# EAGLE design X16_PowerSlab_V2 (EAGLE 9.6.2)

## Sheet 1 of 2
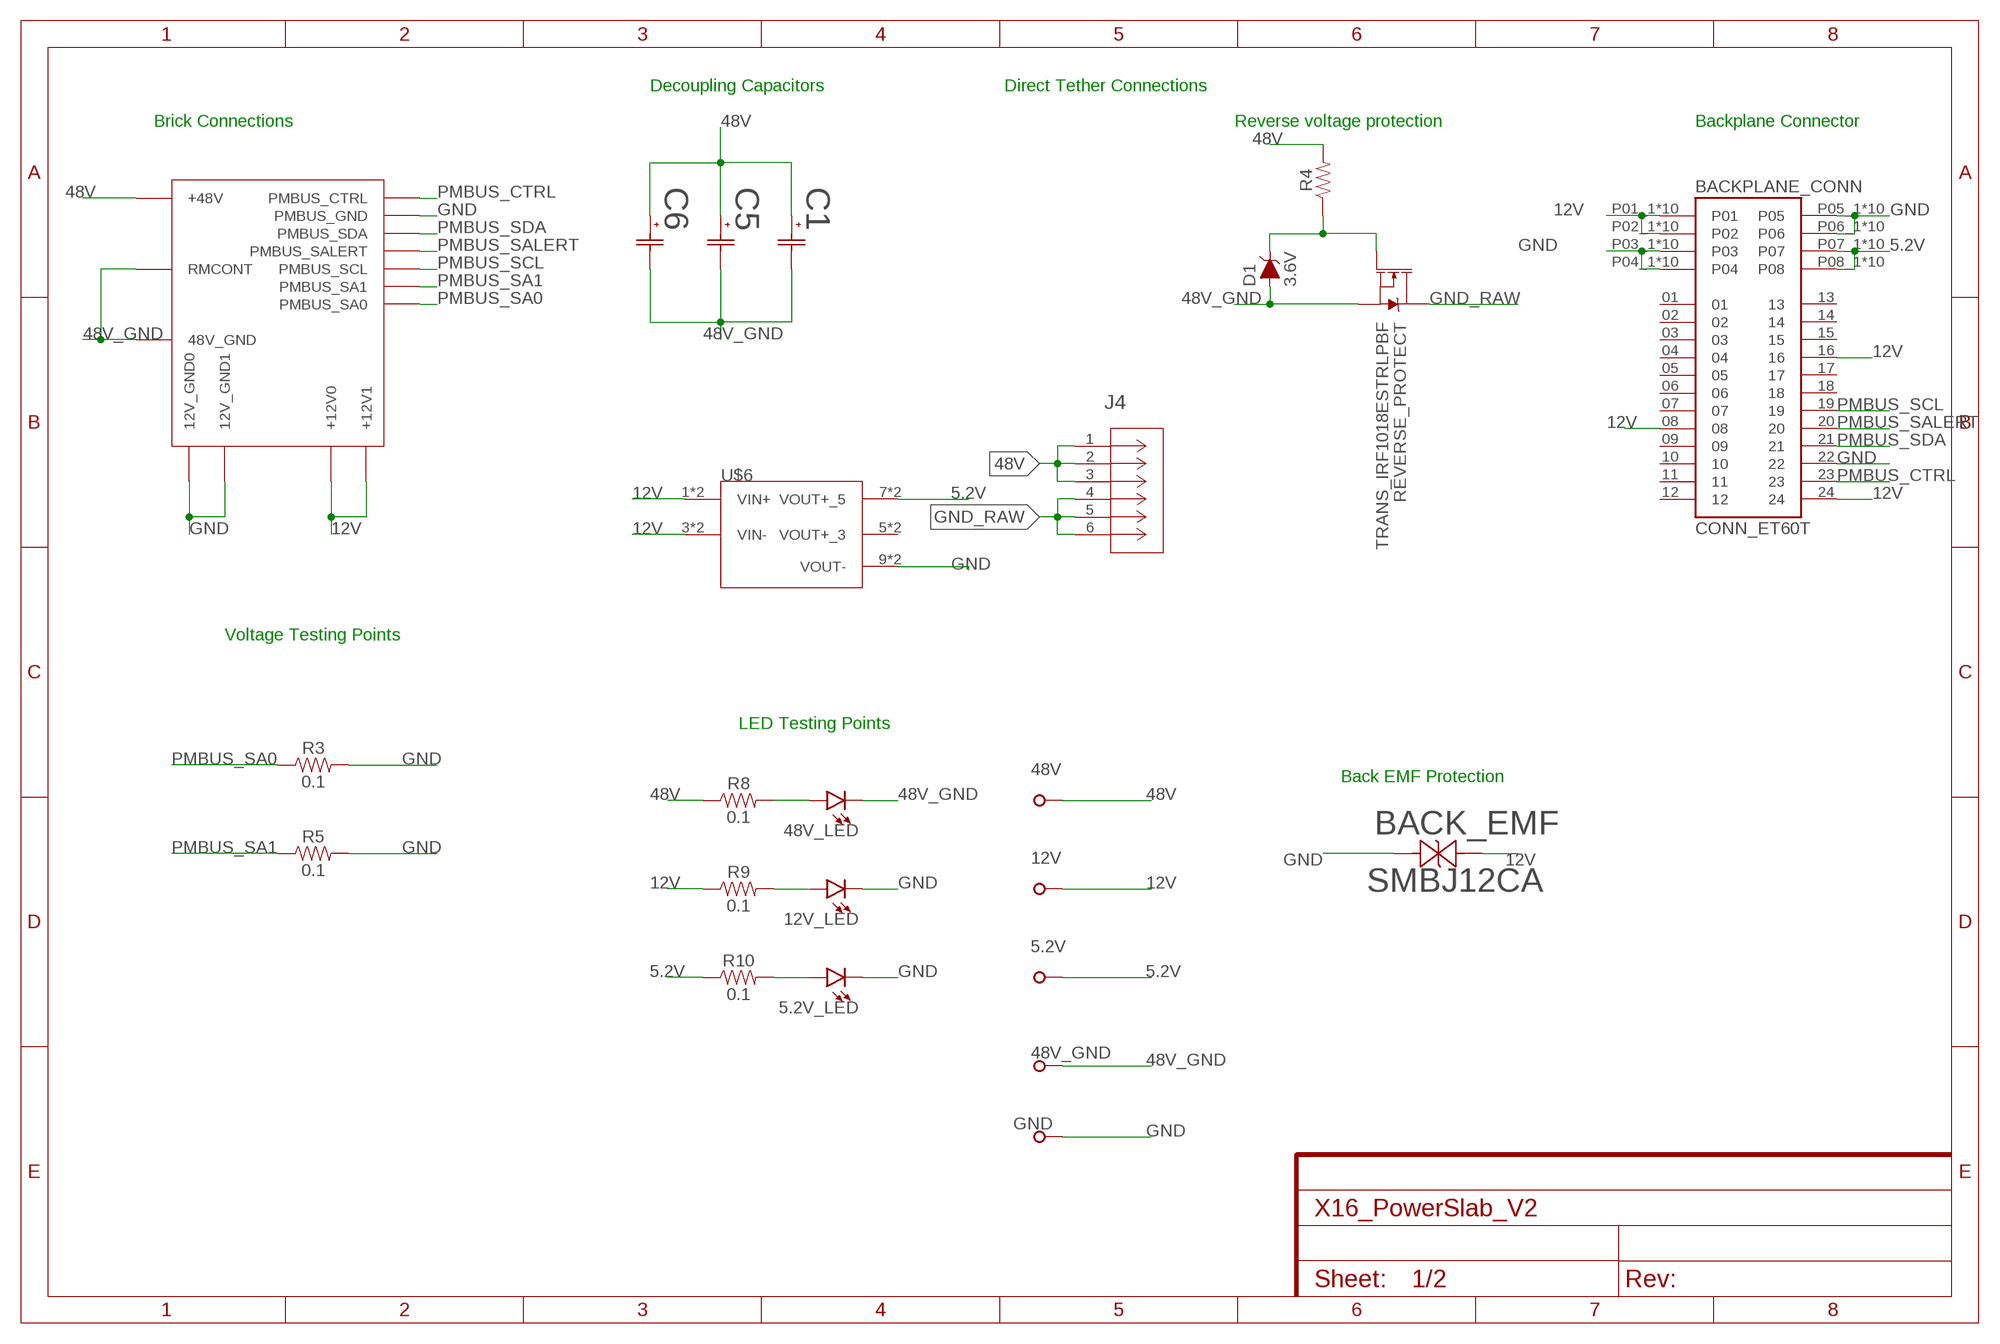
[diagram p0: schematic, sheet 1]

### Parts
5.2V  TESTPOINT_5.04MM  [TESTPOINT_5.04MM]
5.2V_LED  5.2V  LEDCHIPLED_0805  [CHIPLED_0805]
12V  TESTPOINT_5.04MM  [TESTPOINT_5.04MM]
12V_LED  12V  LEDCHIPLED_0805  [CHIPLED_0805]
48V  48V  TESTPOINT_5.04MM  [TESTPOINT_5.04MM]
48V_GND  TESTPOINT_5.04MM  [TESTPOINT_5.04MM]
48V_LED  48V  LEDCHIPLED_0805  [CHIPLED_0805]
BACK_EMF  SMBJ12CA  [SMBJSERIES_LTF]
BACKPLANE_CONN  CONN_ET60T  [SAMTEC_ET60T-D04-3-08-D04-X-R1-S]
BMR480_POWERBRICK  CONN_BMR480_BRICK  [CONN_BMR480_BRICK]
C1  UCM1H331MNL1GS  [CAP_UCD_10X10_NCH]
C5  UCM1H331MNL1GS  [CAP_UCD_10X10_NCH]
C6  UCM1H331MNL1GS  [CAP_UCD_10X10_NCH]
D1  3.6V  DIODE-ZENER-BZT52C3V6S  [SOD-323]
GND  TESTPOINT_5.04MM  [TESTPOINT_5.04MM]
J4  796636-6  [CON6_P5MM_VER_TERM-BLK_TYC]
R3  0.1  0.1OHM-0603-1/3W-1%  [0603]
R4  RESISTOR0603  [0603]
R5  0.1  0.1OHM-0603-1/3W-1%  [0603]
R8  0.1  0.1OHM-0603-1/3W-1%  [0603]
R9  0.1  0.1OHM-0603-1/3W-1%  [0603]
R10  0.1  0.1OHM-0603-1/3W-1%  [0603]
REVERSE_PROTECT  TRANS_IRF1018ESTRLPBF  [D2PAK]
U$6  CONN_DISTRIBUTION_TO_CONVERSION  [TSW-105-05-G-S(D-C)]

### Nets
5.2V: 5.2V.TP BACKPLANE_CONN.P07_1(P07) BACKPLANE_CONN.P07_2(P07) BACKPLANE_CONN.P07_3(P07) BACKPLANE_CONN.P07_4(P07) BACKPLANE_CONN.P07_5(P07) BACKPLANE_CONN.P07_6(P07) BACKPLANE_CONN.P07_7(P07) BACKPLANE_CONN.P07_8(P07) BACKPLANE_CONN.P07_9(P07) BACKPLANE_CONN.P07_10(P07) BACKPLANE_CONN.P08_1(P08) BACKPLANE_CONN.P08_2(P08) BACKPLANE_CONN.P08_3(P08) BACKPLANE_CONN.P08_4(P08) BACKPLANE_CONN.P08_5(P08) BACKPLANE_CONN.P08_6(P08) BACKPLANE_CONN.P08_7(P08) BACKPLANE_CONN.P08_8(P08) BACKPLANE_CONN.P08_9(P08) BACKPLANE_CONN.P08_10(P08) R10.1 U$6.7(VOUT+_5) U$6.8(VOUT+_5) ; also sheet 2
12V: 12V.TP BACK_EMF.1 BACKPLANE_CONN.08 BACKPLANE_CONN.16 BACKPLANE_CONN.24 BACKPLANE_CONN.P01_1(P01) BACKPLANE_CONN.P01_2(P01) BACKPLANE_CONN.P01_3(P01) BACKPLANE_CONN.P01_4(P01) BACKPLANE_CONN.P01_5(P01) BACKPLANE_CONN.P01_6(P01) BACKPLANE_CONN.P01_7(P01) BACKPLANE_CONN.P01_8(P01) BACKPLANE_CONN.P01_9(P01) BACKPLANE_CONN.P01_10(P01) BACKPLANE_CONN.P02_1(P02) BACKPLANE_CONN.P02_2(P02) BACKPLANE_CONN.P02_3(P02) BACKPLANE_CONN.P02_4(P02) BACKPLANE_CONN.P02_5(P02) BACKPLANE_CONN.P02_6(P02) BACKPLANE_CONN.P02_7(P02) BACKPLANE_CONN.P02_8(P02) BACKPLANE_CONN.P02_9(P02) BACKPLANE_CONN.P02_10(P02) BMR480_POWERBRICK.PIN7(+12V1) BMR480_POWERBRICK.PIN8(+12V0) R9.1 U$6.1(VIN+) U$6.2(VIN+) U$6.3(VIN-) U$6.4(VIN-) ; also sheet 2
48V: 48V.TP BMR480_POWERBRICK.PIN1(+48V) C1.1 C5.1 C6.1 J4.1 J4.2 J4.3 R4.2 R8.1
48V_GND: 48V_GND.TP 48V_LED.C BMR480_POWERBRICK.PIN2(RMCONT) BMR480_POWERBRICK.PIN3(48V_GND) C1.2 C5.2 C6.2 D1.A REVERSE_PROTECT.2(S)
GND: 5.2V_LED.C 12V_LED.C BACK_EMF.2 BACKPLANE_CONN.22 BACKPLANE_CONN.P03_1(P03) BACKPLANE_CONN.P03_2(P03) BACKPLANE_CONN.P03_3(P03) BACKPLANE_CONN.P03_4(P03) BACKPLANE_CONN.P03_5(P03) BACKPLANE_CONN.P03_6(P03) BACKPLANE_CONN.P03_7(P03) BACKPLANE_CONN.P03_8(P03) BACKPLANE_CONN.P03_9(P03) BACKPLANE_CONN.P03_10(P03) BACKPLANE_CONN.P04_1(P04) BACKPLANE_CONN.P04_2(P04) BACKPLANE_CONN.P04_3(P04) BACKPLANE_CONN.P04_4(P04) BACKPLANE_CONN.P04_5(P04) BACKPLANE_CONN.P04_6(P04) BACKPLANE_CONN.P04_7(P04) BACKPLANE_CONN.P04_8(P04) BACKPLANE_CONN.P04_9(P04) BACKPLANE_CONN.P04_10(P04) BACKPLANE_CONN.P05_1(P05) BACKPLANE_CONN.P05_2(P05) BACKPLANE_CONN.P05_3(P05) BACKPLANE_CONN.P05_4(P05) BACKPLANE_CONN.P05_5(P05) BACKPLANE_CONN.P05_6(P05) BACKPLANE_CONN.P05_7(P05) BACKPLANE_CONN.P05_8(P05) BACKPLANE_CONN.P05_9(P05) BACKPLANE_CONN.P05_10(P05) BACKPLANE_CONN.P06_1(P06) BACKPLANE_CONN.P06_2(P06) BACKPLANE_CONN.P06_3(P06) BACKPLANE_CONN.P06_4(P06) BACKPLANE_CONN.P06_5(P06) BACKPLANE_CONN.P06_6(P06) BACKPLANE_CONN.P06_7(P06) BACKPLANE_CONN.P06_8(P06) BACKPLANE_CONN.P06_9(P06) BACKPLANE_CONN.P06_10(P06) BMR480_POWERBRICK.PIN4(12V_GND1) BMR480_POWERBRICK.PIN5(12V_GND0) BMR480_POWERBRICK.PIN10(PMBUS_GND) GND.TP R3.2 R5.2 U$6.9(VOUT-) U$6.10(VOUT-) ; also sheet 2
GND_RAW: J4.4 J4.5 J4.6 REVERSE_PROTECT.3(D)
N$7: D1.C R4.1 REVERSE_PROTECT.1(G)
N$9: 48V_LED.A R8.2
N$10: 12V_LED.A R9.2
N$11: 5.2V_LED.A R10.2
PMBUS_CTRL: BACKPLANE_CONN.23 BMR480_POWERBRICK.PIN9(PMBUS_CTRL)
PMBUS_SA0: BMR480_POWERBRICK.PIN15(PMBUS_SA0) R3.1
PMBUS_SA1: BMR480_POWERBRICK.PIN14(PMBUS_SA1) R5.1
PMBUS_SALERT: BACKPLANE_CONN.20 BMR480_POWERBRICK.PIN12(PMBUS_SALERT)
PMBUS_SCL: BACKPLANE_CONN.19 BMR480_POWERBRICK.PIN13(PMBUS_SCL)
PMBUS_SDA: BACKPLANE_CONN.21 BMR480_POWERBRICK.PIN11(PMBUS_SDA)
Unconnected: BACKPLANE_CONN.01 BACKPLANE_CONN.02 BACKPLANE_CONN.03 BACKPLANE_CONN.04 BACKPLANE_CONN.05 BACKPLANE_CONN.06 BACKPLANE_CONN.07 BACKPLANE_CONN.09 BACKPLANE_CONN.10 BACKPLANE_CONN.11 BACKPLANE_CONN.12 BACKPLANE_CONN.13 BACKPLANE_CONN.14 BACKPLANE_CONN.15 BACKPLANE_CONN.17 BACKPLANE_CONN.18 U$6.5(VOUT+_3) U$6.6(VOUT+_3)

### Notes on the sheet
- Decoupling Capacitors | Direct Tether Connections
- Brick Connections | Reverse voltage protection | Backplane Connector
- Voltage Testing Points
- LED Testing Points
- Back EMF Protection

## Sheet 2 of 2
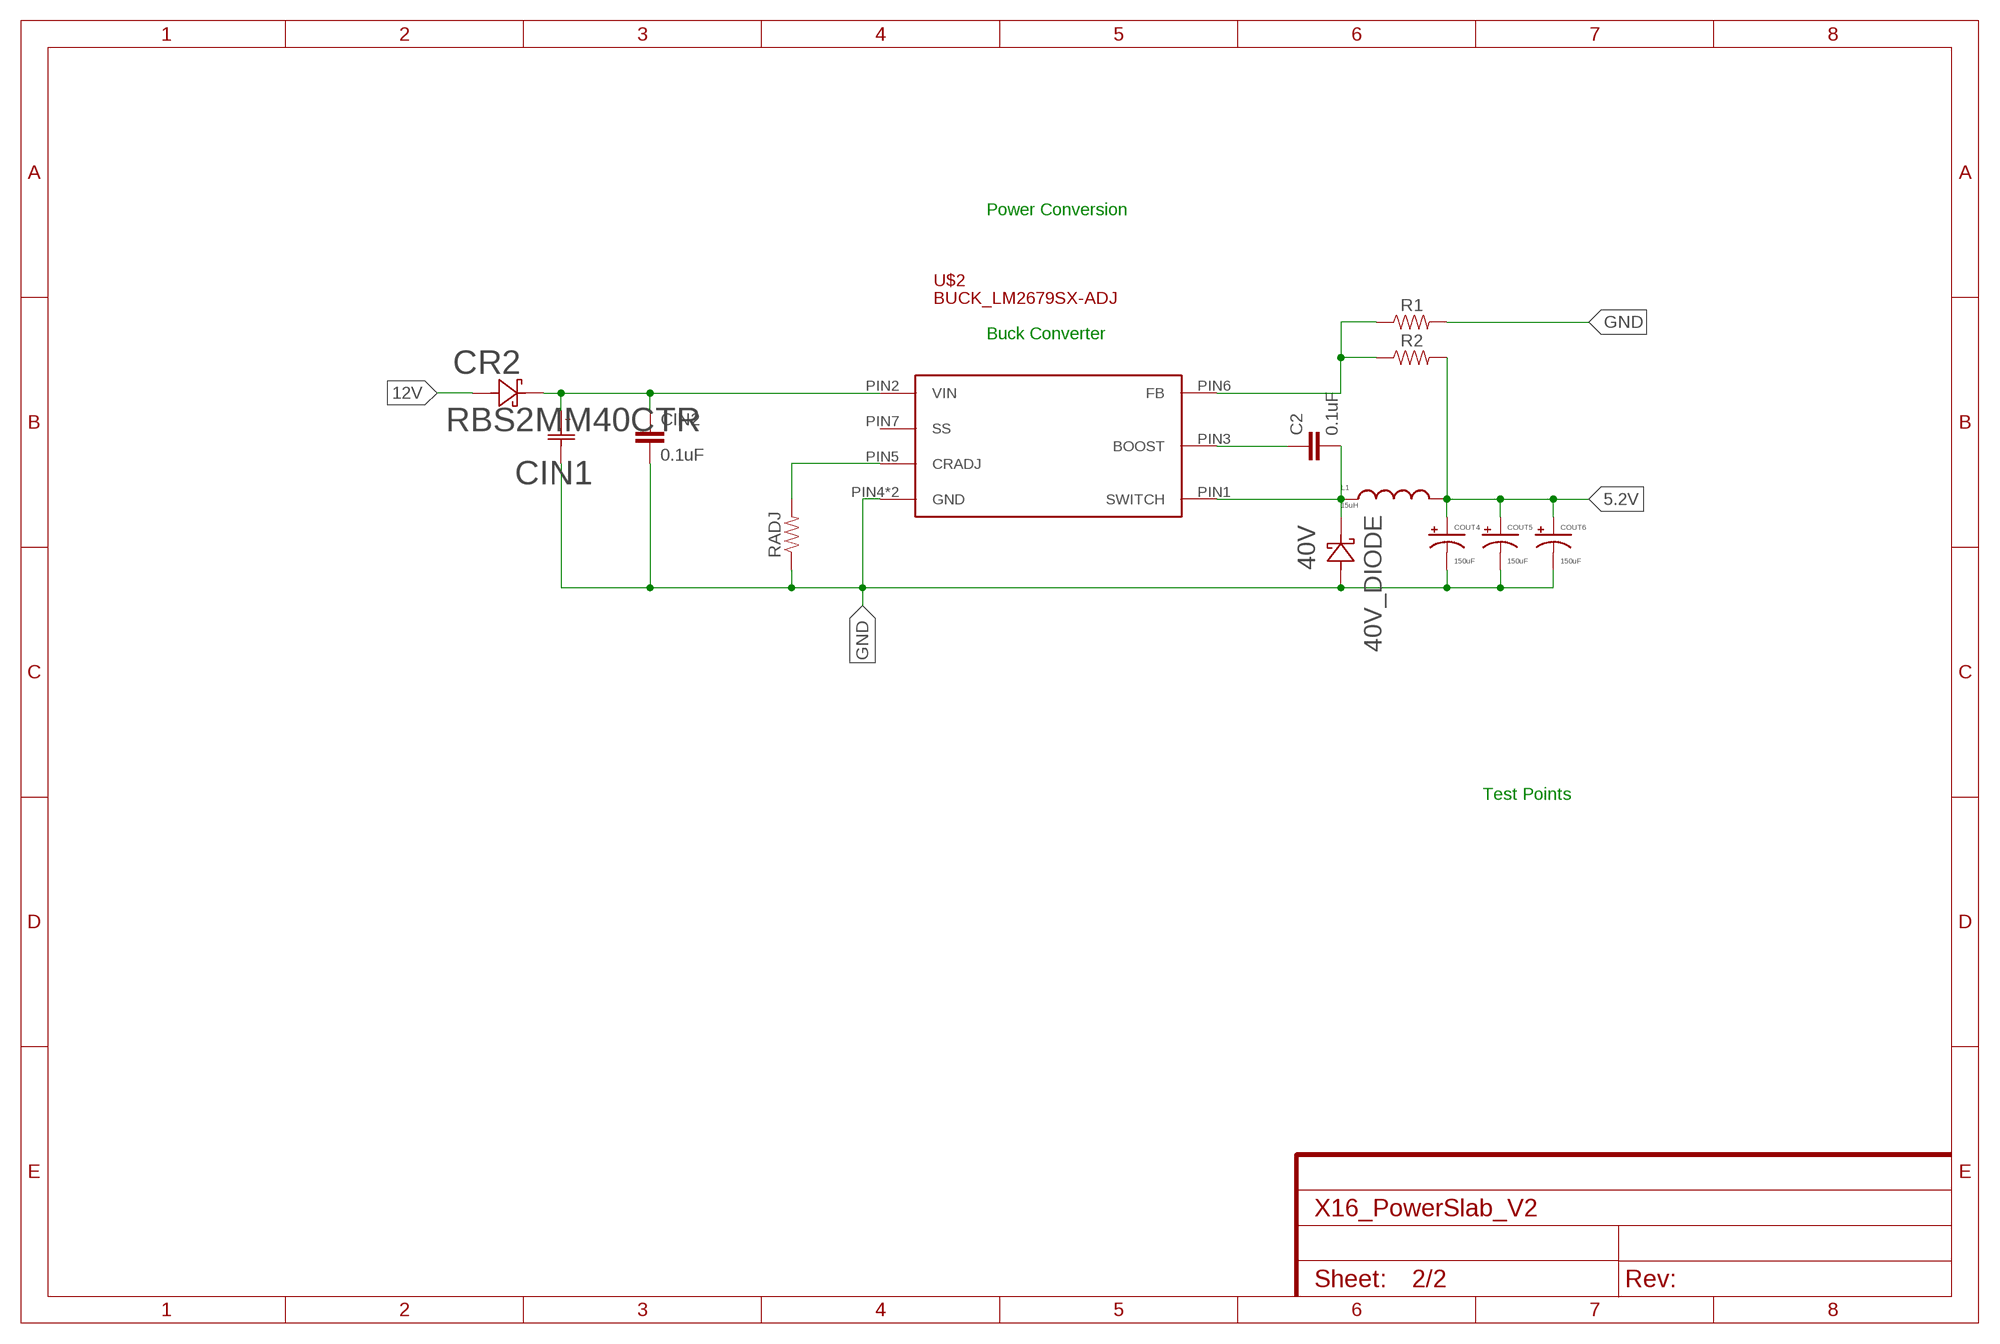
[diagram p1: schematic, sheet 2]

### Parts
40V_DIODE  40V  CDBG520-G  [DO214AC]
C2  0.1uF  0.1UF-0603-25V-(+80/-20%)  [0603]
CIN1  594D187X0016R2T  [CAP_X0016R2T_VIS]
CIN2  0.1uF  0.1UF-0603-25V-(+80/-20%)  [0603]
COUT4  150uF  C-TANTALUM(10UF_150UF)  [2917(7343-31-METRIC)]
COUT5  150uF  C-TANTALUM(10UF_150UF)  [2917(7343-31-METRIC)]
COUT6  150uF  C-TANTALUM(10UF_150UF)  [2917(7343-31-METRIC)]
CR2  RBS2MM40CTR  [SDO_RBS2MM40CTR_ROM]
L1  15uH  HCMA1305  [HCMA1305]
R1  RESISTOR0603  [0603]
R2  RESISTOR0603  [0603]
RADJ  RESISTOR0603  [0603]
U$2  BUCK_LM2679SX-ADJ  [BUCK,LM2679SX-ADJ]

### Nets
5.2V: COUT4.+ COUT5.+ COUT6.+ L1.2 R2.2 ; also sheet 1
12V: CR2.2 ; also sheet 1
GND: 40V_DIODE.A CIN1.2 CIN2.2 COUT4.- COUT5.- COUT6.- R1.2 RADJ.1 U$2.PIN4(GND) U$2.PIN8(GND) ; also sheet 1
N$1: C2.1 U$2.PIN3(BOOST)
N$2: 40V_DIODE.C C2.2 L1.1 U$2.PIN1(SWITCH)
N$4: R1.1 R2.1 U$2.PIN6(FB)
N$8: RADJ.2 U$2.PIN5(CRADJ)
VIN: CIN1.1 CIN2.1 CR2.1 U$2.PIN2(VIN)
Unconnected: U$2.PIN7(SS)

### Notes on the sheet
- Power Conversion
- Buck Converter
- Test Points

## Library data of the parts
5.2V 12V 48V 48V_GND GND = X16-ExtraComponents:TESTPOINT_5.04MM: TEST PIN
5.2V_LED 12V_LED 48V_LED = led:LED: LED OSRAM: - CHIPLED LG R971, LG N971, LY N971, LG Q971, LY Q971, LO R971, LY R971 LH N974, LH R974 LS Q976, LO Q976, LY Q976 LO Q996 - Hyper CHIPLED LW Q18S LB Q993, LB Q99A, LB R99A - SideLED LS A670, LO A670, LY A670, LG A670, LP A670 LB A673, LV A673, LT A673, LW A673 LH A674 LY A675 LS A676, LA A676, LO A676, LY A676, LW A676 LS A679, LY A679, LG A679 - Hyper Micro SIDELED® LS Y876, LA Y876, LO Y876, LY Y876 LT Y87S - SmartLED LW L88C, LW L88S LB L89C, LB L89S, LG L890 LS L89K, LO L89K, LY L89K LS L896, LA L896, LO L896, LY L896 - TOPLED LS T670, LO T670, LY T670, LG T670, LP T670 LSG T670, LSP T670, LSY T670, LOP T670, LYG T670 LG T671, LOG T671, LSG T671 LB T673, LV T673, LT T673, LW T673 LH T674 LS T676, LA T676, LO T676, LY T676, LB T676, LH T676, LSB T676, LW T676 LB T67C, LV T67C, LT T67C, LS T67K, LO T67K, LY T67K, LW E67C LS E67B, LA E67B, LO E67B, LY E67B, LB E67C, LV E67C, LT E67C LW T67C LS T679, LY T679, LG T679 LS T770, LO T770, LY T770, LG T770, LP T770 LB T773, LV T773, LT T773, LW T773 LH T774 LS E675, LA E675, LY E675, LS T675 LS T776, LA T776, LO T776, LY T776, LB T776 LHGB T686 LT T68C, LB T68C - Hyper Mini TOPLED® LB M676 - Mini TOPLED Santana® LG M470 LS M47K, LO M47K, LY M47K Source: http://www.osram.convergy.de LUXEON: - LUMILED® LXK2-PW12-R00, LXK2-PW12-S00, LXK2-PW14-U00, LXK2-PW14-V00 LXK2-PM12-R00, LXK2-PM12-S00, LXK2-PM14-U00 LXK2-PE12-Q00, LXK2-PE12-R00, LXK2-PE12-S00, LXK2-PE14-T00, LXK2-PE14-U00 LXK2-PB12-K00, LXK2-PB12-L00, LXK2-PB12-M00, LXK2-PB14-N00, LXK2-PB14-P00, LXK2-PB14-Q00 LXK2-PR12-L00, LXK2-PR12-M00, LXK2-PR14-Q00, LXK2-PR14-R00 LXK2-PD12-Q00, LXK2-PD12-R00, LXK2-PD12-S00 LXK2-PH12-R00, LXK2-PH12-S00 LXK2-PL12-P00, LXK2-PL12-Q00, LXK2-PL12-R00 Source: www.luxeon.com KINGBRIGHT: KA-3528ASYC Source: www.kingbright.com
40V_DIODE = X15-Conversion-Parts-Library:CDBG520-G
BACK_EMF = X16_Power_Slab:SMBJ12CA; COPYRIGHT: Copyright (C) 2023 Ultra Librarian. All rights reserved.; MANUFACTURER_PART_NUMBER: SMBJ12CA; MFR_NAME: Littelfuse Inc
BACKPLANE_CONN = X16_Power_Slab:CONN_ET60T: 32 Connector Header, Male Pins and Blades Through Hole, Right Angle Black EXTreme Ten60Power; MANUFACTURER: Samtec; MAXIMUM_PACKAGE_HEIGHT: 10.0 mm; PARTREV: J; STANDARD: Manufacturer Recommendations
BMR480_POWERBRICK = X16_Power_Slab:CONN_BMR480_BRICK
C1 C5 C6 = X16_Power_Slab:UCM1H331MNL1GS; COPYRIGHT: Copyright (C) 2023 Ultra Librarian. All rights reserved.; MANUFACTURER_PART_NUMBER: UCM1H331MNL1GS; MFR_NAME: Nichicon; SPICEPREFIX: C
C2 CIN2 = SparkFun-Capacitors:0.1UF: 0.1µF ceramic capacitors A capacitor is a passive two-terminal electrical component used to store electrical energy temporarily in an electric field.; PROD_ID: CAP-00810
CIN1 = X16_Power_Slab:594D187X0016R2T; COPYRIGHT: Copyright (C) 2023 Ultra Librarian. All rights reserved.; MANUFACTURER_PART_NUMBER: 594D187X0016R2T; MFR_NAME: Vishay
COUT4-COUT6 = X15-Conversion-Parts-Library:C-TANTALUM(10UF_150UF)
CR2 = X16_Power_Slab:RBS2MM40CTR; COPYRIGHT: Copyright (C) 2023 Ultra Librarian. All rights reserved.; MANUFACTURER_PART_NUMBER: RBS2MM40CTR; MFR_NAME: ROHM Semiconductor
D1 = SparkFun-DiscreteSemi:DIODE-ZENER: Zener Diode A Zener diode allows current to flow from its anode to its cathode like a normal semiconductor diode, but it also permits current to flow in the reverse direction when its "Zener voltage" is reached. - WIkipedia; PROD_ID: DIO-08199
J4 = X16_Power_Slab:796636-6; COPYRIGHT: Copyright (C) 2023 Ultra Librarian. All rights reserved.; MANUFACTURER_PART_NUMBER: 796636-6; MFR_NAME: TE Connectivity
L1 = X15-Conversion-Parts-Library:HCMA1305: Eaton HCMA1305-150-R Inductor
R1 R2 R4 RADJ = SparkFun-Resistors:RESISTOR: Generic Resistor Package
R3 R5 R8-R10 = SparkFun-Resistors:0.1OHM: 0.1Ω resistor A resistor is a passive two-terminal electrical component that implements electrical resistance as a circuit element. Resistors act to reduce current flow, and, at the same time, act to lower voltage levels within circuits. - Wikipedia; PROD_ID: RES-15715
REVERSE_PROTECT = X15_Brickstribution:TRANS_IRF1018ESTRLPBF
U$2 = X16_Power_Slab:BUCK_LM2679SX-ADJ
U$6 = X16_Power_Slab:CONN_DISTRIBUTION_TO_CONVERSION

## Board
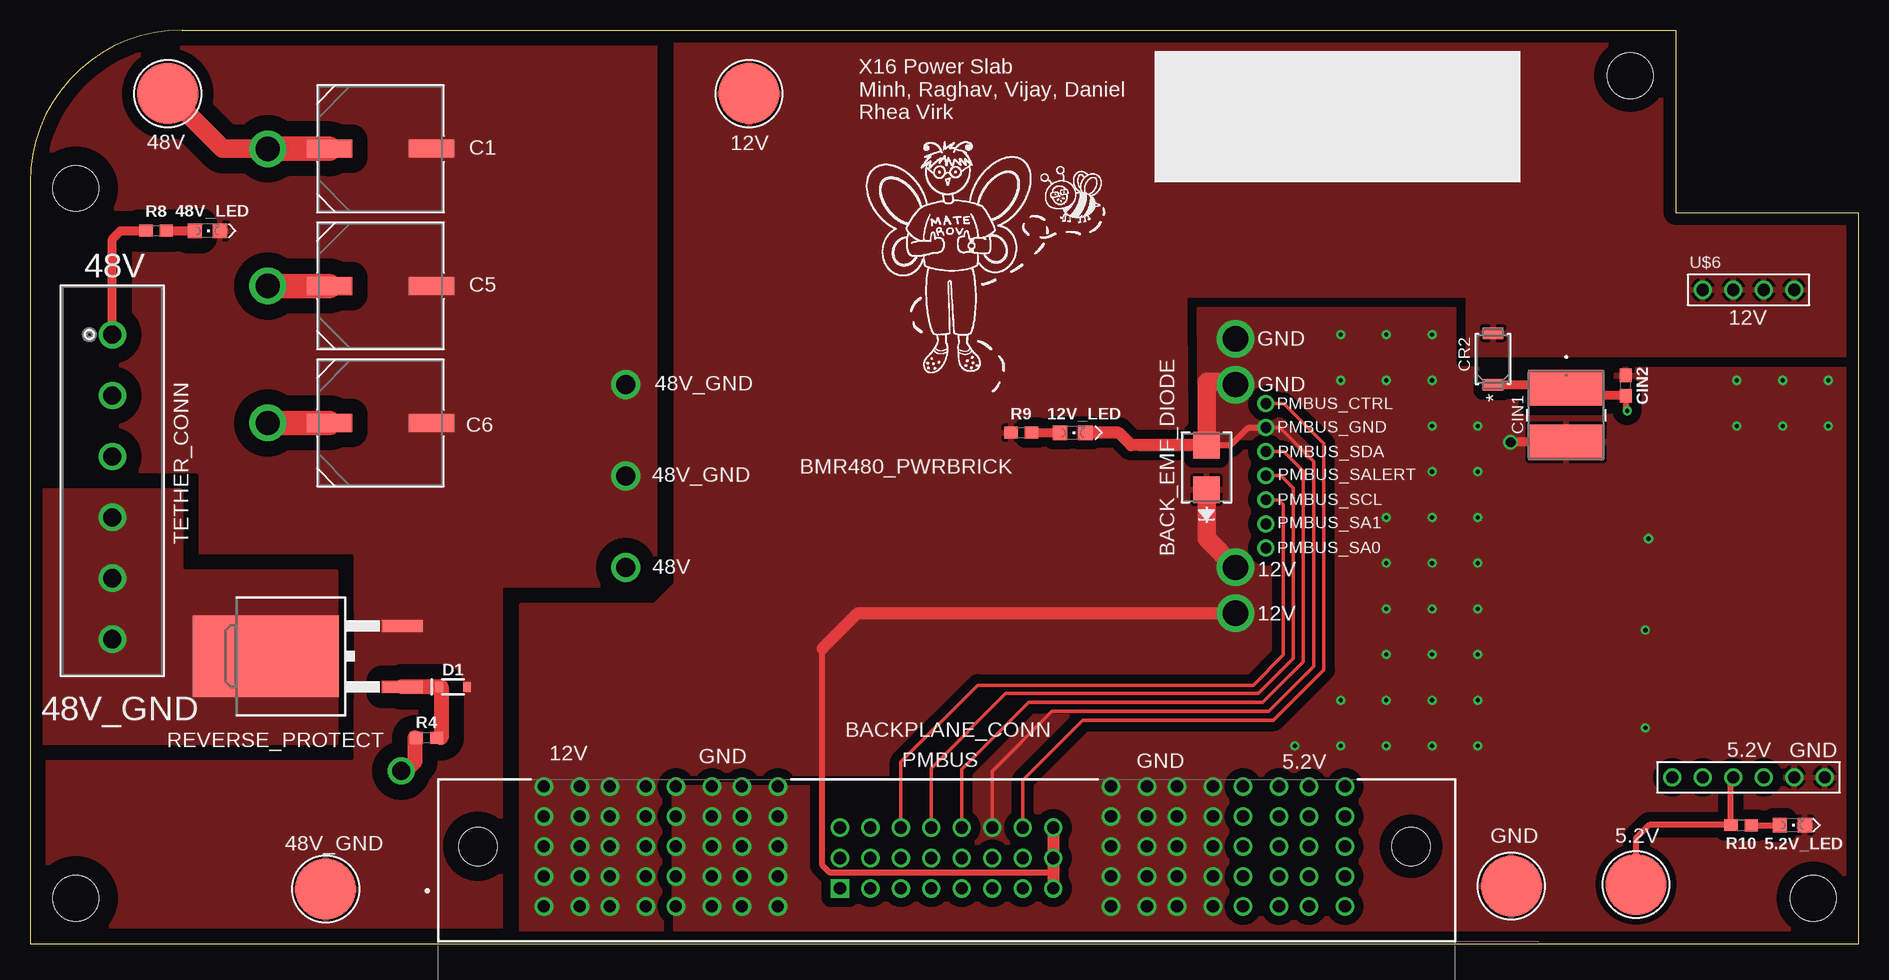
[diagram p2: board, top side]
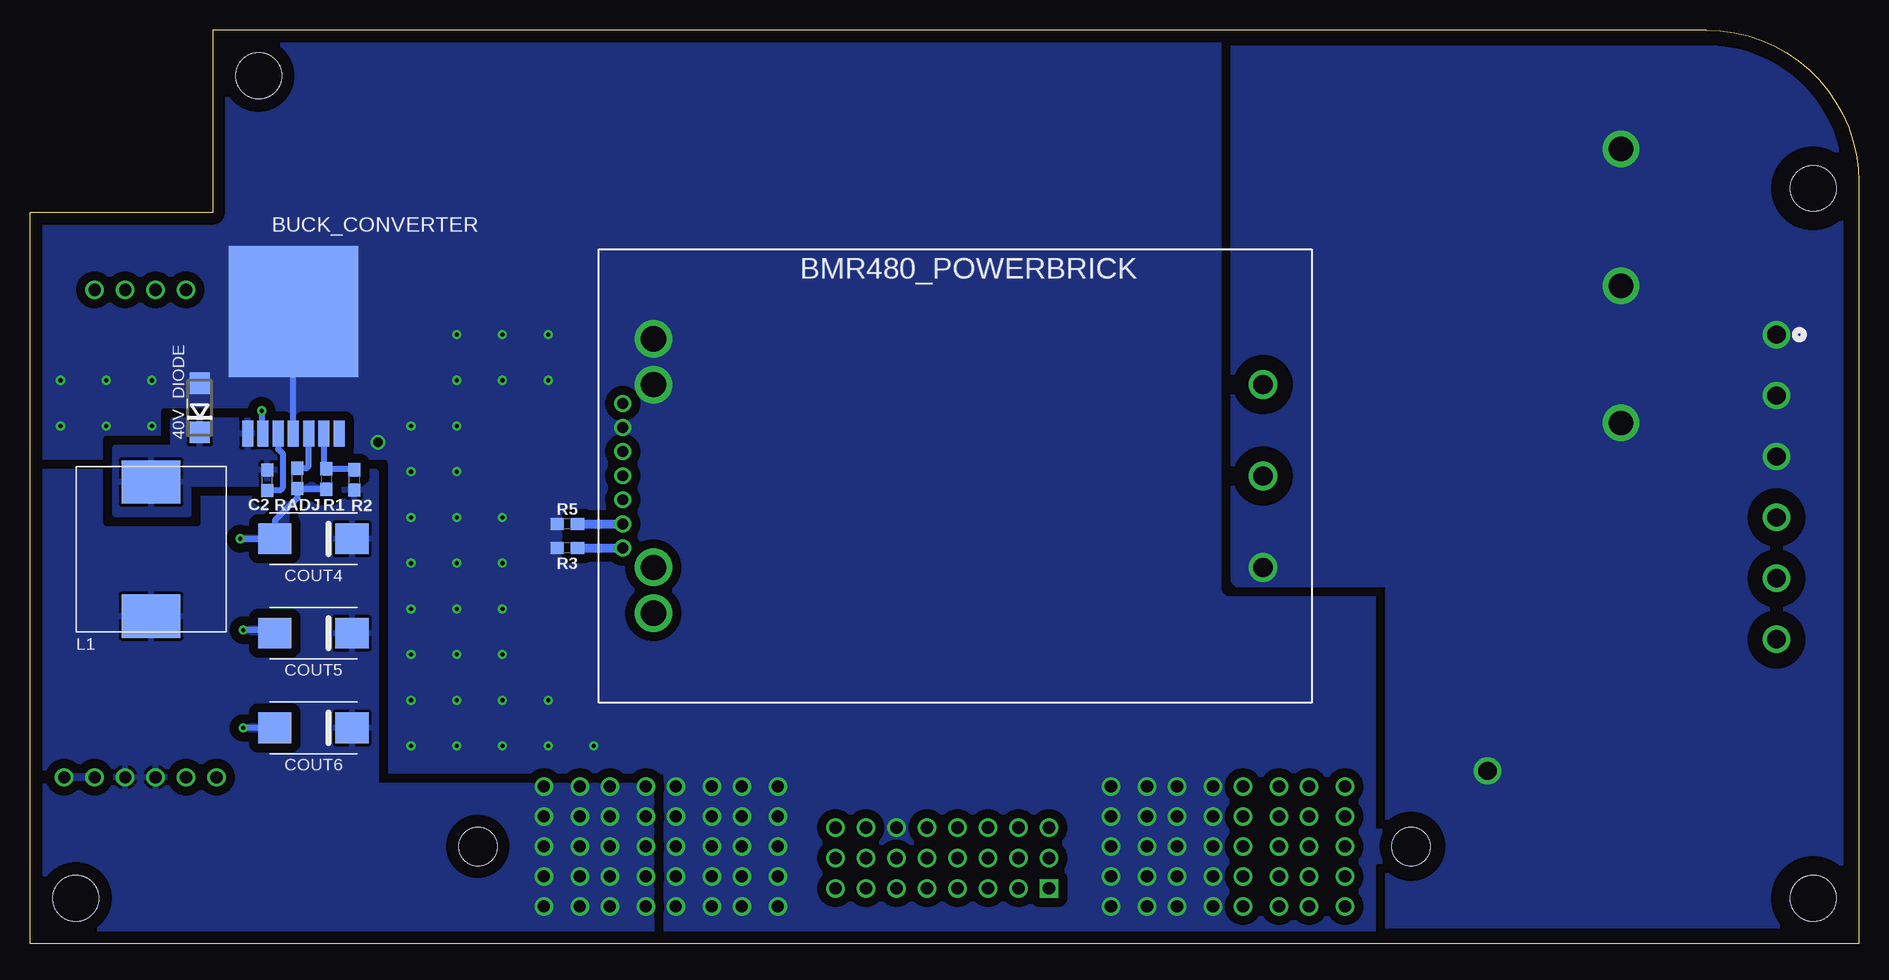
[diagram p3: board, bottom side, seen from below]

Size 152.4 x 76.2 mm. Coordinates in mm from the lower left corner, seen from the top.
Outline: 0,0 152.4,0 152.4,60.96 137.16,60.96 137.16,76.2 12.7,76.2 arc90 0,63.5 0,0
Copper layers (1*16): Top 0.035mm / dielectric 1.5mm / Bottom 0.035mm
Design rules "477": minimum track width 6mil, minimum drill 0.35mm, track to track 6mil, track to pad 6mil, pad to pad 6mil, via to via 6mil, smd to smd 6mil, copper to edge 40mil, drill to drill 6mil, minimum pad ring 10mil, minimum via ring 8mil, stop-mask expansion 4mil, vias tented up to drill 0mil, thermal gap 10mil

### Footprints (pad centres in the part's own frame; a part is rotated, then mirrored left to right if it is on the bottom)
TESTPOINT_5.04MM = smd 5.08 x 5.08: TP 0,0
CHIPLED_0805 = smd 1.2 x 1.2: A 0,-1.05; C 0,1.05
DO214AC = smd 1.8 x 1.7: A 2.05,0; C -2.05,0
SMBJSERIES_LTF = smd 2.184 x 2.184: 1 -1.854,0; 2 1.854,0
SAMTEC_ET60T-D04-3-08-D04-X-R1-S = drill 1.02 square: 01 -8.71,-3.5 | drill 1.02: 02 -6.17,-3.5; 03 -3.63,-3.5; 04 -1.09,-3.5; 05 1.45,-3.5; 06 3.99,-3.5; 07 6.53,-3.5; 08 9.07,-3.5; 09 -8.71,-0.96; 10 -6.17,-0.96; 11 -3.63,-0.96; 12 -1.09,-0.96; 13 1.45,-0.96; 14 3.99,-0.96; 15 6.53,-0.96; 16 9.07,-0.96; 17 -8.71,1.58; 18 -6.17,1.58; 19 -3.63,1.58; 20 -1.09,1.58; 21 1.45,1.58; 22 3.99,1.58; 23 6.53,1.58; 24 9.07,1.58; P01_1 -33.38,5; P01_2 -33.38,2.5; P01_3 -33.38,0; P01_4 -33.38,-2.5; P01_5 -33.38,-5; P01_6 -30.38,-5; P01_7 -30.38,-2.5; P01_8 -30.38,0; P01_9 -30.38,2.5; P01_10 -30.38,5; P02_1 -27.88,5; P02_2 -27.88,2.5; P02_3 -27.88,0; P02_4 -27.88,-2.5; P02_5 -27.88,-5; P02_6 -24.88,-5; P02_7 -24.88,-2.5; P02_8 -24.88,0; P02_9 -24.88,2.5; P02_10 -24.88,5; P03_1 -22.38,5; P03_2 -22.38,2.5; P03_3 -22.38,0; P03_4 -22.38,-2.5; P03_5 -22.38,-5; P03_6 -19.38,-5; P03_7 -19.38,-2.5; P03_8 -19.38,0; P03_9 -19.38,2.5; P03_10 -19.38,5; P04_1 -16.88,5; P04_2 -16.88,2.5; P04_3 -16.88,0; P04_4 -16.88,-2.5; P04_5 -16.88,-5; P04_6 -13.88,-5; P04_7 -13.88,-2.5; P04_8 -13.88,0; P04_9 -13.88,2.5; P04_10 -13.88,5; P05_1 13.88,5; P05_2 13.88,2.5; P05_3 13.88,0; P05_4 13.88,-2.5; P05_5 13.88,-5; P05_6 16.88,-5; P05_7 16.88,-2.5; P05_8 16.88,0; P05_9 16.88,2.5; P05_10 16.88,5; P06_1 19.38,5; P06_2 19.38,2.5; P06_3 19.38,0; P06_4 19.38,-2.5; P06_5 19.38,-5; P06_6 22.38,-5; P06_7 22.38,-2.5; P06_8 22.38,0; P06_9 22.38,2.5; P06_10 22.38,5; P07_1 24.88,5; P07_2 24.88,2.5; P07_3 24.88,0; P07_4 24.88,-2.5; P07_5 24.88,-5; P07_6 27.88,-5; P07_7 27.88,-2.5; P07_8 27.88,0; P07_9 27.88,2.5; P07_10 27.88,5; P08_1 30.38,5; P08_2 30.38,2.5; P08_3 30.38,0; P08_4 30.38,-2.5; P08_5 30.38,-5; P08_6 33.38,-5; P08_7 33.38,-2.5; P08_8 33.38,0; P08_9 33.38,2.5; P08_10 33.38,5 | hole 3.2: 38.88,0; -38.88,0
CONN_BMR480_BRICK = drill 1.6: PIN1 4.06,26.52; PIN2 4.06,18.9; PIN3 4.06,11.28 | drill 2.108: PIN4 54.86,7.47; PIN5 54.86,11.28; PIN7 54.86,26.52; PIN8 54.86,30.33 | drill 0.9: PIN9 57.4,12.855; PIN10 57.4,14.861; PIN11 57.4,16.868; PIN12 57.4,18.875; PIN13 57.4,20.881; PIN14 57.4,22.888; PIN15 57.4,24.894
CAP_UCD_10X10_NCH = smd 3.81 x 1.499: 1 -4.255,0; 2 4.255,0
0603 = smd 1.1 x 1: 1 -0.85,0; 2 0.85,0
CAP_X0016R2T_VIS = smd 2.972 x 6.299: 1 -2.261,0; 2 2.261,0
2917(7343-31-METRIC) = smd 2.77 x 2.55: + -3.22,0; - 3.22,0
SDO_RBS2MM40CTR_ROM = smd 0.965 x 1.702: 1 -2.146,0; 2 2.146,0
SOD-323 = smd 0.63 x 0.83: A 1.15,0; C -1.15,0
6-32-HOLE = hole 3.81: 0,0
CON6_P5MM_VER_TERM-BLK_TYC = drill 1.524 pad 2.032: 1 0,0; 2 5.08,0; 3 10.16,0; 4 15.24,0; 5 20.32,0; 6 25.4,0
HCMA1305 = smd 3.6 x 4.9: 1 -5.6,0; 2 5.6,0
D2PAK = smd 3.4 x 1: 1 -6.552,2.54; 2 -6.552,-2.54 | smd 12.14 x 6.8: 3 4.818,0
BUCK,LM2679SX-ADJ = smd 2.16 x 0.91: PIN1 0,-7.62; PIN2 0,-6.35; PIN3 0,-5.08; PIN4 0,-3.81; PIN5 0,-2.54; PIN6 0,-1.27; PIN7 0,0 | smd 10.918 x 10.8: PIN8 -10.195,-3.81
TSW-105-05-G-S(D-C) = drill 1.016: 1 -3.81,20.32; 2 -1.27,20.32; 3 1.27,20.32; 4 3.81,20.32; 5 -6.35,-20.32; 6 -3.81,-20.32; 7 -1.27,-20.32; 8 1.27,-20.32; 9 3.81,-20.32; 10 6.35,-20.32

### Placement (x,y rotation side)
5.2V  133.83,4.95 0 top
5.2V_LED  146.86,9.91 270 top
12V  59.92,70.89 0 top
12V_LED  86.89,42.62 270 top
40V_DIODE  138.25,44.7 90 bottom
48V  11.48,70.89 0 top
48V_GND  24.64,4.57 0 top
48V_LED  14.78,59.46 270 top
BACK_EMF  98.04,39.73 90 top
BACKPLANE_CONN  76.2,8.13 0 top
BMR480_POWERBRICK  45.59,57.91 180 bottom
C1  29.21,66.29 0 top
C2  132.61,38.66 90 bottom
C5  29.21,54.86 0 top
C6  29.21,43.43 0 top
CIN1  128.02,44.09 270 top
CIN2  132.99,46.56 90 top
COUT4  128.78,33.78 180 bottom
COUT5  128.78,25.91 180 bottom
COUT6  128.78,18.01 180 bottom
CR2  121.92,48.77 90 top
D1  35.26,21.44 0 top
GND  123.44,4.83 0 top
H1  6-32-HOLE  [6-32-HOLE]  3.81,3.81 0 bottom
H2  6-32-HOLE  [6-32-HOLE]  3.81,62.99 0 bottom
H3  6-32-HOLE  [6-32-HOLE]  148.59,3.81 0 bottom
H4  6-32-HOLE  [6-32-HOLE]  133.35,72.39 0 bottom
J4  6.86,50.8 270 top
L1  142.32,32.92 270 bottom
R1  127.71,38.76 270 bottom
R2  125.4,38.68 270 bottom
R3  107.62,33.02 180 bottom
R4  33.05,17.2 180 top
R5  107.62,35.03 180 bottom
R8  10.52,59.46 0 top
R9  82.6,42.62 0 top
R10  142.6,9.91 359.6 top
RADJ  130.12,38.81 90 bottom
REVERSE_PROTECT  24.46,23.98 180 top
U$2  126.64,42.55 270 bottom
U$6  143.21,34.21 0 top

### Tracks (layer width: path | path; a pad name or v marks a point on that pad's centre or on a via)
5.2V
  Top 0.508: U$6.7 141.75,13.7 R10.1 134.96,9.91 133.83,8.79 5.2V.TP
  pour Bottom (isolate 0.762, rank 2): 123.6,39.37 123.6,13.21 100.61,13.21 100.61,1.02 150.37,1.02 153.67,4.32 153.67,38.84 153.14,39.37
  pour Bottom (isolate 0.762, no thermals): 100.61,13.13 111.35,13.13 111.35,1.47 100.61,1.47
12V
  Top 0.508: 66.03,24.63 66.03,6.55 66.65,5.93 85.27,5.93 BACKPLANE_CONN.08
  Top 1.016: 66.03,24.63 68.98,27.58 BMR480_POWERBRICK.PIN8 | BACKPLANE_CONN.24 BACKPLANE_CONN.16 BACKPLANE_CONN.08
  Top 1.524: BACK_EMF.1 98.04,33.8 BMR480_POWERBRICK.PIN7
  pour Top (isolate 0.762, rank 2): 41.66,-1.02 52.58,-1.02 52.58,14.27 75.06,14.27 75.06,19.28 103.29,19.28 103.87,45.69 96.27,45.69 96.23,54.15 119.86,54.13 119.86,49.17 153.59,49.17 153.59,77.72 54.41,77.72 53.85,77.17 53.85,29.97 52.07,28.19 40.97,28.19 40.97,-1.27 41.4,-1.27
  pour Top (isolate 0.762, no thermals): 98.17,33.66 102.01,33.66 102.77,33.66 102.77,26.72 102.77,24.97 98.63,24.97 97.92,24.97 97.92,33.63
  pour Top (isolate 0.762, no thermals): 41.53,14.73 52.55,14.73 52.55,-0.64 41.53,-0.64
48V  (via drill 1.52, 2.03)
  Top 0.508: R4.2 32.08,17.2
  Top 0.762: J4.1 6.86,58.76 7.56,59.46 R8.1
  Top 1.27: 32.08,17.2 32.08,15.19 31.32,14.43 v30.94,14.43
  Top 1.524: 48V.TP 16.08,66.29 21.34,66.29
  Top 2.032: C1.1 21.34,66.29 v19.81,66.29 | C5.1 v19.81,54.86 | C6.1 v19.81,43.43
  pour Bottom (isolate 1.27, rank 2, no thermals): -6.1,82.04 -6.1,0.25 -1.27,-4.57 35.31,-4.57 39.19,-0.69 39.19,29.97 51.82,29.97 52.07,30.23 52.07,83.82 51.56,84.33 -3.81,84.33
48V_GND
  pour Top (isolate 1.27, rank 2): -0.99,69.75 -0.99,-0.13 39.19,-0.13 39.19,29.97 51.82,29.97 52.07,30.23 52.07,76.25 5.51,76.25
  pour Top (isolate 0.762, no thermals): 47.37,49.17 51.66,49.17 51.66,36.75 47.98,36.75 47.37,36.75
  pour Top (isolate 0.762, no thermals): 28.5,28.37 34.11,28.37 34.11,24.97 28.5,24.97
  pour Top (isolate 0.762, no thermals): 30.76,68.25 36.27,68.25 36.27,41.12 32.56,41.12 30.76,41.12
  pour Top (isolate 0.762, no thermals): 36.37,16.33 36.37,22.89 37.87,22.89 37.87,16.33
GND  (via drill 0.35, 0.8)
  Top 0.305: BACKPLANE_CONN.22 80.19,14.4 85.17,19.38 103.23,19.38 106.98,23.14 106.98,40.21 104.14,43.05 BMR480_POWERBRICK.PIN10
  Top 0.508: BACK_EMF.2 100.05,41.58 101.52,43.05 BMR480_POWERBRICK.PIN10
  Top 0.762: CIN1.2 123.42,41.83 v123.39,41.81
  Top 1.016: BACK_EMF.2 91.77,41.58 90.72,42.63 12V_LED.C
  Top 1.524: BACK_EMF.2 98.04,46.86 100.22,46.86 BMR480_POWERBRICK.PIN5
  Bottom 0.508: COUT4.- v134.87,33.78 | COUT5.- 132.25,26.16 v134.62,26.16 | v134.62,18.01 COUT6.- 131.01,17.02 | 131.74,33.53 COUT4.- | R1.2 127.76,37.96 RADJ.1 130.12,37.19 132,35.31 COUT4.- | U$2.PIN4 U$2.PIN8
  other vias: 116.84,39.37 116.84,35.56 116.84,31.75 116.84,27.94 116.84,24.13 116.84,43.18 116.84,46.99 120.65,43.18 120.65,35.56 120.65,31.75 120.65,27.94 120.65,24.13 113.03,46.99 109.22,46.99 142.24,46.99 146.05,46.99 149.86,46.99 149.86,43.18 146.05,43.18 142.24,43.18 113.03,35.56 113.03,31.75 113.03,27.94 113.03,24.13 113.03,20.32 116.84,20.32 120.65,20.32 120.65,16.51 116.84,16.51 113.03,16.51 109.22,16.51 109.22,20.32 105.41,16.51 120.65,39.37 116.84,50.8 113.03,50.8 109.22,50.8
  pour Bottom (isolate 0.762, rank 6, no thermals): -1.78,80.77 -1.78,-0.25 0.25,-2.29 152.65,-2.29 155.45,0.51 155.45,78.99 153.92,80.52 -1.52,80.52
  pour Top (isolate 0.762, rank 6, no thermals): -2.54,80.52 -2.54,-1.02 -0.25,-3.3 119.07,-3.3 118.97,27.59 121.79,30.4 121.79,82.3 -0.76,82.3
  pour Top (isolate 0.813, rank 3): 118.59,82.19 158.01,82.19 158.01,-4.8 118.59,-4.8
GND_RAW
  pour Top (isolate 0.762, no thermals): -2.26,37.74 12.52,37.74 12.52,31.01 25.45,31.01 25.45,16.79 -2.26,16.79
N$1
  Bottom 0.508: U$2.PIN3 131.72,41.26 131.35,40.89 131.35,38.03 131.57,37.81 C2.1
N$2
  Bottom 0.762: U$2.PIN1 134.26,42.16
  pour Bottom (isolate 0.203): 131.83,40.39 131.83,38.35 139.19,38.35 139.19,35.81 145.29,35.81 145.29,41.4 140.46,41.4 140.46,43.69 133.86,43.69 133.6,43.69 133.6,41.66 133.1,41.66
N$4
  Bottom 0.508: U$2.PIN6 127.91,39.81 R1.1 125.48,39.61 R2.1
N$7
  Top 0.762: 34.25,17.2 R4.1
  Top 1.27: REVERSE_PROTECT.1 D1.C 34.25,21.44 34.25,17.2
N$8
  Bottom 0.508: U$2.PIN5 129.18,39.84 129.36,39.66 RADJ.2
N$9
  Top 0.762: R8.2 48V_LED.A
N$10
  Top 0.762: R9.2 12V_LED.A
N$11
  Top 0.508: R10.2 5.2V_LED.A
PMBUS_CTRL
  Top 0.305: BACKPLANE_CONN.23 82.73,13.64 87.73,18.64 103.61,18.64 107.82,22.86 107.82,41.71 104.47,45.06 BMR480_POWERBRICK.PIN9
PMBUS_SA0
  Bottom 0.762: R3.1 BMR480_POWERBRICK.PIN15
PMBUS_SA1
  Bottom 0.762: R5.1 BMR480_POWERBRICK.PIN14
PMBUS_SALERT
  Top 0.305: BACKPLANE_CONN.20 75.11,14.66 81.33,20.88 102.36,20.88 105.28,23.8 105.28,38 104.24,39.04 BMR480_POWERBRICK.PIN12
PMBUS_SCL
  Top 0.305: BACKPLANE_CONN.19 72.57,15.17 78.97,21.57 101.93,21.57 104.44,24.08 104.44,36.65 104.06,37.03 BMR480_POWERBRICK.PIN13
  Top 0.508: BMR480_POWERBRICK.PIN13
PMBUS_SDA
  Top 0.305: BACKPLANE_CONN.21 77.65,14.56 83.24,20.14 102.74,20.14 106.1,23.5 106.1,39.42 104.47,41.04 BMR480_POWERBRICK.PIN11
VIN  (via drill 0.35)
  Top 0.508: CIN2.1 132.99,44.55 v133.1,44.45
  Top 0.762: CR2.1 127.48,46.62 | 127.48,46.62 127.75,46.62 CIN1.1 | CIN2.1 128.4,45.71 127.48,46.62
  Bottom 0.508: v133.1,44.45 133.1,42.65 U$2.PIN2

### Text on the board
tPlace: X16 Power Slab / Minh, Raghav, Vijay, Daniel / Rhea Virk | C1 | 48V | C5 | C6 | CIN1 | BMR480_PWRBRICK | TETHER_CONN | BACK_EMF_DIODE | 48V_GND | 12V | GND | PMBUS | GND | 5.2V
bPlace: BUCK_CONVERTER
bOrigins: C:/Users/Minh/Downloads/crocs - Google Search.bmp
tNames: 12V | GND | CR2 | 48V_GND | GND | PMBUS_CTRL | PMBUS_GND | PMBUS_SDA | 48V_GND | PMBUS_SALERT | PMBUS_SCL | PMBUS_SA1 | PMBUS_SA0 | 48V | 12V | 12V | 5.2V | GND